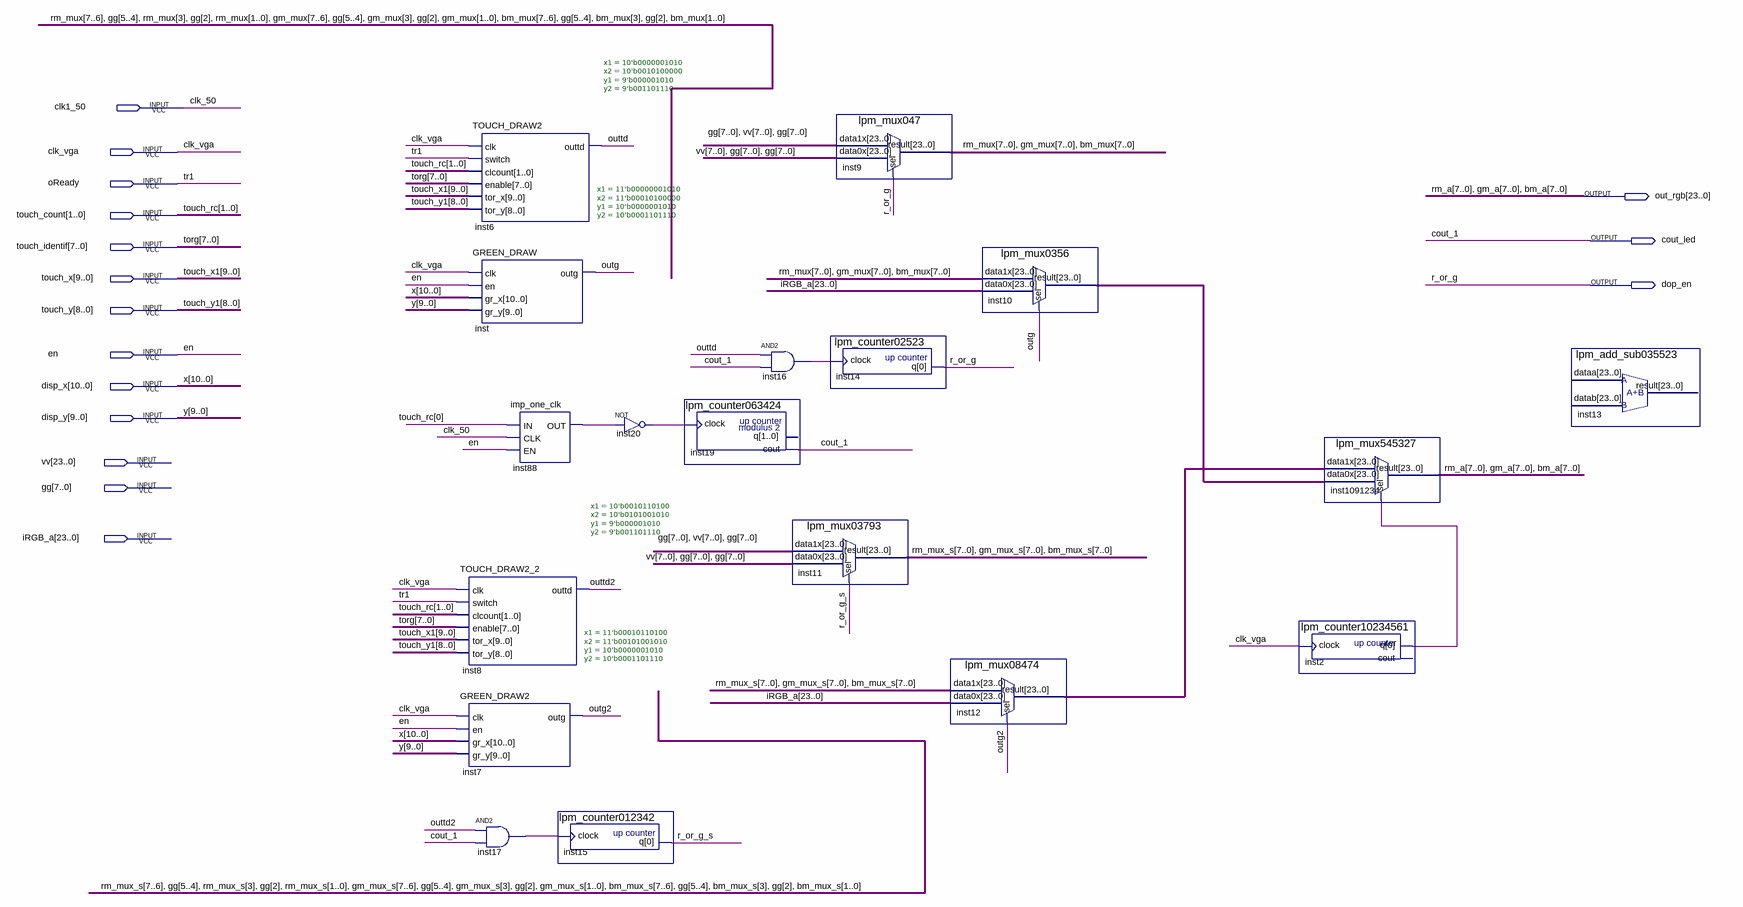
[diagram p0: schematic sheet]
// Quartus schematic keys.bdf as structural Verilog: 18 symbols, 16 pins
module keys (
  input  clk1_50,
  input  clk_vga,
  input  oReady,
  input  [1:0] touch_count,
  input  [7:0] touch_identif,
  input  [9:0] touch_x,
  input  [8:0] touch_y,
  input  en,
  input  [10:0] disp_x,
  input  [9:0] disp_y,
  input  [23:0] vv,
  input  [7:0] gg,
  input  [23:0] iRGB_a,
  output [23:0] out_rgb,
  output cout_led,
  output dop_en
);

  wire inst2_q, inst16_out, inst17_out, inst20_out, inst88_out, outg, outg2, outtd, outtd2, r_or_g_s;
  wire [7:0] bm_mux, bm_mux_s, gm_mux, gm_mux_s, rm_mux, rm_mux_s;
  wire [23:0] inst10_result, inst12_result;

  TOUCH_DRAW2 #(.x1(10'b0000001010), .x2(10'b0010100000), .y1(9'b000001010), .y2(9'b001101110)) inst6 (
    .clk(clk_vga), .switch(oReady), .clcount(touch_count), .enable(touch_identif), .tor_x(touch_x),
    .tor_y(touch_y), .outtd(outtd));
  GREEN_DRAW #(.x1(11'b00000001010), .x2(11'b00010100000), .y1(10'b0000001010), .y2(10'b0001101110)) inst (
    .clk(clk_vga), .en(en), .gr_x(disp_x), .gr_y(disp_y), .outg(outg));
  TOUCH_DRAW2_2 #(.x1(10'b0010110100), .x2(10'b0101001010), .y1(9'b000001010), .y2(9'b001101110)) inst8 (
    .clk(clk_vga), .switch(oReady), .clcount(touch_count), .enable(touch_identif), .tor_x(touch_x),
    .tor_y(touch_y), .outtd(outtd2));
  GREEN_DRAW2 #(.x1(11'b00010110100), .x2(11'b00101001010), .y1(10'b0000001010), .y2(10'b0001101110)) inst7 (
    .clk(clk_vga), .en(en), .gr_x(disp_x), .gr_y(disp_y), .outg(outg2));
  and inst17 (inst17_out, outtd2, cout_led);
  imp_one_clk inst88 (.IN(touch_count[0]), .CLK(clk1_50), .EN(en), .OUT(inst88_out));
  lpm_counter012342 inst15 (.clock(inst17_out), .q(r_or_g_s));
  not inst20 (inst20_out, inst88_out);
  lpm_counter063424 inst19 (.clock(inst20_out), .cout(cout_led));  // open: q
  and inst16 (inst16_out, outtd, cout_led);
  lpm_counter02523 inst14 (.clock(inst16_out), .q(dop_en));
  lpm_mux03793 inst11 (
    .data1x({gg, vv[7:0], gg}), .data0x({vv[7:0], gg, gg}), .sel(r_or_g_s),
    .result({rm_mux_s, gm_mux_s, bm_mux_s}));
  lpm_mux047 inst9 (
    .data1x({gg, vv[7:0], gg}), .data0x({vv[7:0], gg, gg}), .sel(dop_en), .result({rm_mux, gm_mux, bm_mux}));
  lpm_mux0356 inst10 (.data1x({rm_mux, gm_mux, bm_mux}), .data0x(iRGB_a), .sel(outg), .result(inst10_result));
  lpm_mux08474 inst12 (.data1x({rm_mux_s, gm_mux_s, bm_mux_s}), .data0x(iRGB_a), .sel(outg2), .result(inst12_result));
  lpm_mux545327 inst1091234 (.data1x(inst12_result), .data0x(inst10_result), .sel(inst2_q), .result(out_rgb));
  lpm_counter10234561 inst2 (.clock(clk_vga), .q(inst2_q));  // open: cout
  lpm_add_sub035523 inst13 ();  // open: dataa, datab, result

  // Other names for the same wires on the sheet: bm_a[7:0] = out_rgb[7:0]; clk_50 = clk1_50; cout_1 = cout_led;
  //   gm_a[7:0] = out_rgb[15:8]; r_or_g = dop_en; rm_a[7:0] = out_rgb[23:16]; torg[7:0] = touch_identif;
  //   touch_rc[1:0] = touch_count; touch_x1[9:0] = touch_x; touch_y1[8:0] = touch_y; tr1 = oReady; x[10:0] = disp_x;
  //   y[9:0] = disp_y
endmodule
